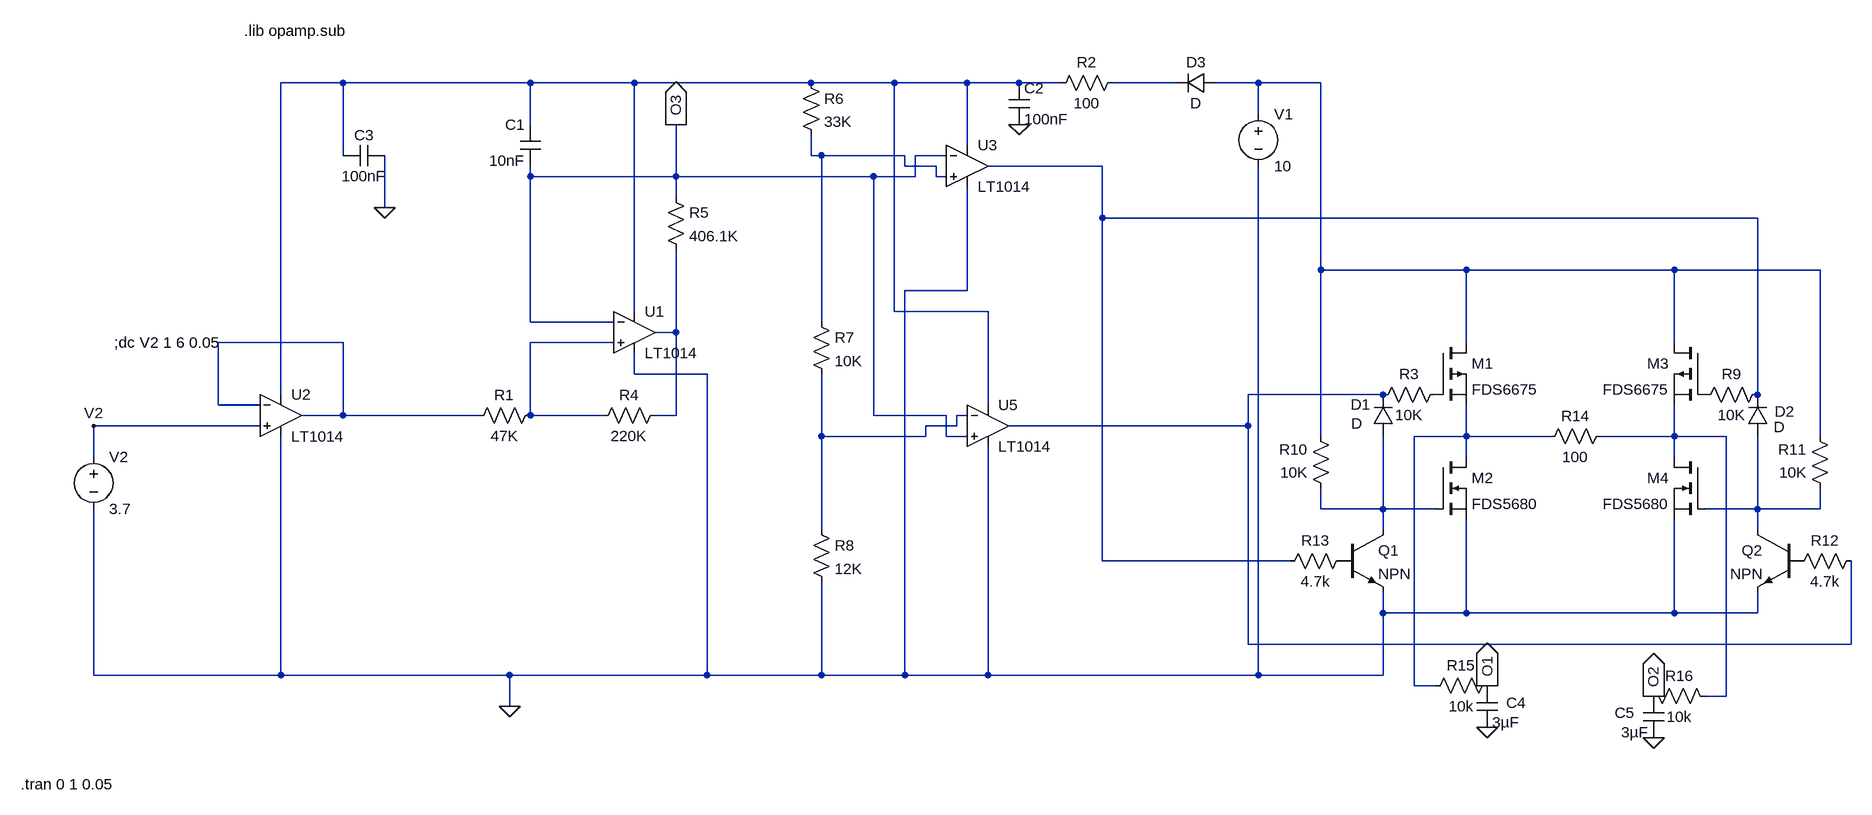
[diagram p0: schematic Gorup4 - Circuit.asc]
Gorup4 - Circuit.asc, the LTspice schematic file:
Version 4
SHEET 1 2352 808
WIRE -240 -288 -336 -288
WIRE 48 -288 -240 -288
WIRE 208 -288 48 -288
WIRE 480 -288 208 -288
WIRE 608 -288 480 -288
WIRE 720 -288 608 -288
WIRE 800 -288 720 -288
WIRE 864 -288 800 -288
WIRE 1040 -288 944 -288
WIRE 1168 -288 1104 -288
WIRE 1264 -288 1168 -288
WIRE 1168 -240 1168 -288
WIRE 48 -224 48 -288
WIRE 720 -192 720 -288
WIRE -240 -176 -240 -288
WIRE 480 -176 480 -208
WIRE 496 -176 480 -176
WIRE 624 -176 496 -176
WIRE 688 -176 640 -176
WIRE 624 -160 624 -176
WIRE 672 -160 624 -160
WIRE 928 -160 752 -160
WIRE 48 -144 48 -160
WIRE 272 -144 272 -224
WIRE 272 -144 48 -144
WIRE 576 -144 272 -144
WIRE 640 -144 640 -176
WIRE 640 -144 576 -144
WIRE 672 -144 672 -160
WIRE 688 -144 672 -144
WIRE 272 -112 272 -144
WIRE -176 -96 -176 -176
WIRE 928 -80 928 -160
WIRE 1936 -80 928 -80
WIRE 1264 0 1264 -288
WIRE 1488 0 1264 0
WIRE 1808 0 1488 0
WIRE 2032 0 1808 0
WIRE 720 32 720 -128
WIRE 720 32 624 32
WIRE 208 64 208 -288
WIRE 608 64 608 -288
WIRE 752 64 608 64
WIRE 48 80 48 -144
WIRE 176 80 48 80
WIRE 496 80 496 -176
WIRE 272 96 272 -32
WIRE 272 96 240 96
WIRE -240 112 -432 112
WIRE 176 112 48 112
WIRE 1488 112 1488 0
WIRE 1808 112 1808 0
WIRE 208 160 208 128
WIRE 320 160 208 160
WIRE -336 192 -336 -288
WIRE 1360 192 1152 192
WIRE 1936 192 1936 -80
WIRE -432 208 -432 112
WIRE -368 208 -432 208
WIRE 752 208 752 64
WIRE -240 224 -240 112
WIRE -240 224 -304 224
WIRE -32 224 -240 224
WIRE 48 224 48 112
WIRE 160 224 48 224
WIRE 272 224 272 96
WIRE 272 224 240 224
WIRE 576 224 576 -144
WIRE 688 224 576 224
WIRE 720 224 704 224
WIRE -368 240 -624 240
WIRE 704 240 704 224
WIRE 704 240 656 240
WIRE 1152 240 1152 192
WIRE 1152 240 784 240
WIRE 496 256 496 160
WIRE 656 256 656 240
WIRE 656 256 496 256
WIRE 688 256 688 224
WIRE 720 256 688 256
WIRE 1264 256 1264 0
WIRE 1488 256 1488 208
WIRE 1488 256 1408 256
WIRE 1616 256 1488 256
WIRE 1808 256 1808 208
WIRE 1808 256 1696 256
WIRE 1888 256 1808 256
WIRE 2032 256 2032 0
WIRE -624 288 -624 240
WIRE 1488 288 1488 256
WIRE 1808 288 1808 256
WIRE 1264 368 1264 336
WIRE 1360 368 1360 256
WIRE 1360 368 1264 368
WIRE 1440 368 1360 368
WIRE 1936 368 1936 256
WIRE 1936 368 1856 368
WIRE 2032 368 2032 336
WIRE 2032 368 1936 368
WIRE 496 400 496 256
WIRE 1360 400 1360 368
WIRE 1936 400 1936 368
WIRE 928 448 928 -80
WIRE 1216 448 928 448
WIRE 1360 528 1360 496
WIRE 1488 528 1488 384
WIRE 1488 528 1360 528
WIRE 1808 528 1808 384
WIRE 1808 528 1488 528
WIRE 1936 528 1936 496
WIRE 1936 528 1808 528
WIRE 1152 576 1152 240
WIRE 2080 576 2080 448
WIRE 2080 576 1152 576
WIRE -624 624 -624 368
WIRE -336 624 -336 256
WIRE -336 624 -624 624
WIRE 16 624 -336 624
WIRE 320 624 320 160
WIRE 320 624 16 624
WIRE 496 624 496 480
WIRE 496 624 320 624
WIRE 624 624 624 32
WIRE 624 624 496 624
WIRE 752 624 752 272
WIRE 752 624 624 624
WIRE 1168 624 1168 -160
WIRE 1168 624 752 624
WIRE 1360 624 1360 528
WIRE 1360 624 1168 624
WIRE 1408 640 1408 256
WIRE 1440 640 1408 640
WIRE 1888 656 1888 256
WIRE 1888 656 1856 656
WIRE 16 672 16 624
FLAG -176 -96 0
FLAG 800 -224 0
FLAG 16 672 0
FLAG 272 -224 O3
IOPIN 272 -224 Out
FLAG -624 240 V2
FLAG 1520 640 O1
IOPIN 1520 640 Out
FLAG 1776 656 O2
IOPIN 1776 656 Out
FLAG 1520 704 0
FLAG 1776 720 0
SYMBOL res 256 208 R90
WINDOW 0 0 56 VBottom 0
WINDOW 3 32 56 VTop 0
SYMATTR InstName R4
SYMATTR Value 220K
SYMATTR SpiceLine tol=1 pwr=0.1
SYMBOL res 464 -304 R0
SYMATTR InstName R6
SYMATTR Value 33K
SYMBOL res 480 64 R0
SYMATTR InstName R7
SYMATTR Value 10K
SYMBOL res 480 384 R0
SYMATTR InstName R8
SYMATTR Value 12K
SYMBOL cap 64 -160 R180
WINDOW 0 24 64 Left 0
WINDOW 3 24 8 Left 0
SYMATTR InstName C1
SYMATTR Value 10nF
SYMBOL cap -240 -160 R270
WINDOW 0 32 32 VTop 0
WINDOW 3 0 32 VBottom 0
SYMATTR InstName C3
SYMATTR Value 100nF
SYMBOL res 256 -128 R0
SYMATTR InstName R5
SYMATTR Value 406.1K
SYMBOL cap 784 -288 R0
SYMATTR InstName C2
SYMATTR Value 100nF
SYMBOL res 64 208 R90
WINDOW 0 0 56 VBottom 0
WINDOW 3 32 56 VTop 0
SYMATTR InstName R1
SYMATTR Value 47K
SYMATTR SpiceLine tol=1 pwr=0.1
SYMBOL voltage 1168 -256 R0
WINDOW 123 0 0 Left 0
WINDOW 39 0 0 Left 0
SYMATTR InstName V1
SYMATTR Value 10
SYMBOL voltage -624 272 R0
WINDOW 123 0 0 Left 0
WINDOW 39 0 0 Left 0
SYMATTR InstName V2
SYMATTR Value 3.7
SYMBOL Opamps\\LT1014 752 176 R0
SYMATTR InstName U5
SYMBOL Opamps\\LT1014 208 32 R0
SYMATTR InstName U1
SYMBOL Opamps\\LT1014 -336 160 R0
SYMATTR InstName U2
SYMBOL Opamps\\LT1014 720 -224 R0
SYMATTR InstName U3
SYMBOL res 1456 176 R90
WINDOW 0 0 56 VBottom 0
WINDOW 3 32 56 VTop 0
SYMATTR InstName R3
SYMATTR Value 10K
SYMATTR SpiceLine tol=1 pwr=0.1
SYMBOL pmos 1440 112 R0
SYMATTR InstName M1
SYMATTR Value FDS6675
SYMBOL nmos 1440 288 R0
SYMATTR InstName M2
SYMATTR Value FDS5680
SYMBOL pmos 1856 112 M0
SYMATTR InstName M3
SYMATTR Value FDS6675
SYMBOL nmos 1856 288 M0
SYMATTR InstName M4
SYMATTR Value FDS5680
SYMBOL res 1952 176 R90
WINDOW 0 0 56 VBottom 0
WINDOW 3 32 56 VTop 0
SYMATTR InstName R9
SYMATTR Value 10K
SYMATTR SpiceLine tol=1 pwr=0.1
SYMBOL diode 1376 256 R180
WINDOW 0 35 49 Left 0
WINDOW 3 48 20 Left 0
SYMATTR InstName D1
SYMBOL diode 1952 256 R180
WINDOW 0 -41 38 Left 0
WINDOW 3 -26 14 Left 0
SYMATTR InstName D2
SYMBOL res 1280 352 R180
WINDOW 0 36 76 Left 0
WINDOW 3 36 40 Left 0
SYMATTR InstName R10
SYMATTR Value 10K
SYMATTR SpiceLine tol=1 pwr=0.1
SYMBOL res 2048 352 R180
WINDOW 0 36 76 Left 0
WINDOW 3 36 40 Left 0
SYMATTR InstName R11
SYMATTR Value 10K
SYMATTR SpiceLine tol=1 pwr=0.1
SYMBOL npn 1296 400 R0
SYMATTR InstName Q1
SYMBOL npn 2000 400 M0
SYMATTR InstName Q2
SYMBOL res 2096 432 R90
WINDOW 0 0 56 VBottom 0
WINDOW 3 32 56 VTop 0
SYMATTR InstName R12
SYMATTR Value 4.7k
SYMBOL res 1312 432 R90
WINDOW 0 0 56 VBottom 0
WINDOW 3 32 56 VTop 0
SYMATTR InstName R13
SYMATTR Value 4.7k
SYMBOL diode 1104 -304 R90
WINDOW 0 0 32 VBottom 0
WINDOW 3 32 32 VTop 0
SYMATTR InstName D3
SYMBOL res 960 -304 R90
WINDOW 0 0 56 VBottom 0
WINDOW 3 32 56 VTop 0
SYMATTR InstName R2
SYMATTR Value 100
SYMBOL res 1712 240 R90
WINDOW 0 0 56 VBottom 0
WINDOW 3 32 56 VTop 0
SYMATTR InstName R14
SYMATTR Value 100
SYMBOL res 1536 624 R90
WINDOW 0 0 56 VBottom 0
WINDOW 3 32 56 VTop 0
SYMATTR InstName R15
SYMATTR Value 10k
SYMBOL cap 1504 640 R0
WINDOW 0 45 26 Left 0
SYMATTR InstName C4
SYMATTR Value 3µF
SYMBOL res 1760 640 M90
WINDOW 0 0 56 VBottom 0
WINDOW 3 32 56 VTop 0
SYMATTR InstName R16
SYMATTR Value 10k
SYMBOL cap 1792 656 M0
WINDOW 0 45 26 Left 0
SYMATTR InstName C5
SYMATTR Value 3µF
TEXT -392 -368 Left 0 !.lib opamp.sub
TEXT -736 792 Left 0 !.tran 0 1 0.05
TEXT -592 112 Left 0 !;dc V2 1 6 0.05

The netlist it stands for:
* Gorup4 - Circuit.asc
R4 N006 N008 220K tol=1 pwr=0.1
R6 N001 N004 33K
R7 N004 N010 10K
R8 N010 0 12K
C1 O3 N001 10nF
C3 N001 0 100nF
R5 O3 N006 406.1K
C2 N001 0 100nF
R1 N008 N007 47K tol=1 pwr=0.1
V1 N003 0 10
V2 V2 0 3.7
XU5 O3 N010 N001 0 N009 LT1014  ; pins In+ In- V+ V- OUT
XU1 N008 O3 N001 0 N006 LT1014  ; pins In+ In- V+ V- OUT
XU2 V2 N007 N001 0 N007 LT1014  ; pins In+ In- V+ V- OUT
XU3 N004 O3 N001 0 N005 LT1014  ; pins In+ In- V+ V- OUT
R3 P001 N009 10K tol=1 pwr=0.1
M1 N003 P001 N011 N011 FDS6675
M2 N011 N013 0 0 FDS5680
M3 N003 P002 N012 N012 FDS6675
M4 N012 N014 0 0 FDS5680
R9 N005 P002 10K tol=1 pwr=0.1
D1 N013 N009 D
D2 N014 N005 D
R10 N013 N003 10K tol=1 pwr=0.1
R11 N014 N003 10K tol=1 pwr=0.1
Q1 N013 P003 0 0 NPN
Q2 N014 P004 0 0 NPN
R12 N009 P004 4.7k
R13 P003 N005 4.7k
D3 N003 N002 D
R2 N002 N001 100
R14 N012 N011 100
R15 O1 N011 10k
C4 O1 0 3µF
R16 O2 N012 10k
C5 O2 0 3µF
.model D D
.lib standard.dio
.model NPN NPN
.model PNP PNP
.lib standard.bjt
.model NMOS NMOS
.model PMOS PMOS
.lib standard.mos
.lib opamp.sub
.tran 0 1 0.05
;dc V2 1 6 0.05
.backanno
.end